# Altium schematic sheet Sensors.SchDoc: Sensors
size B; Author: Alexander Curtiss; DocumentNumber: 4; SheetNumber: 4; SheetTotal: 6
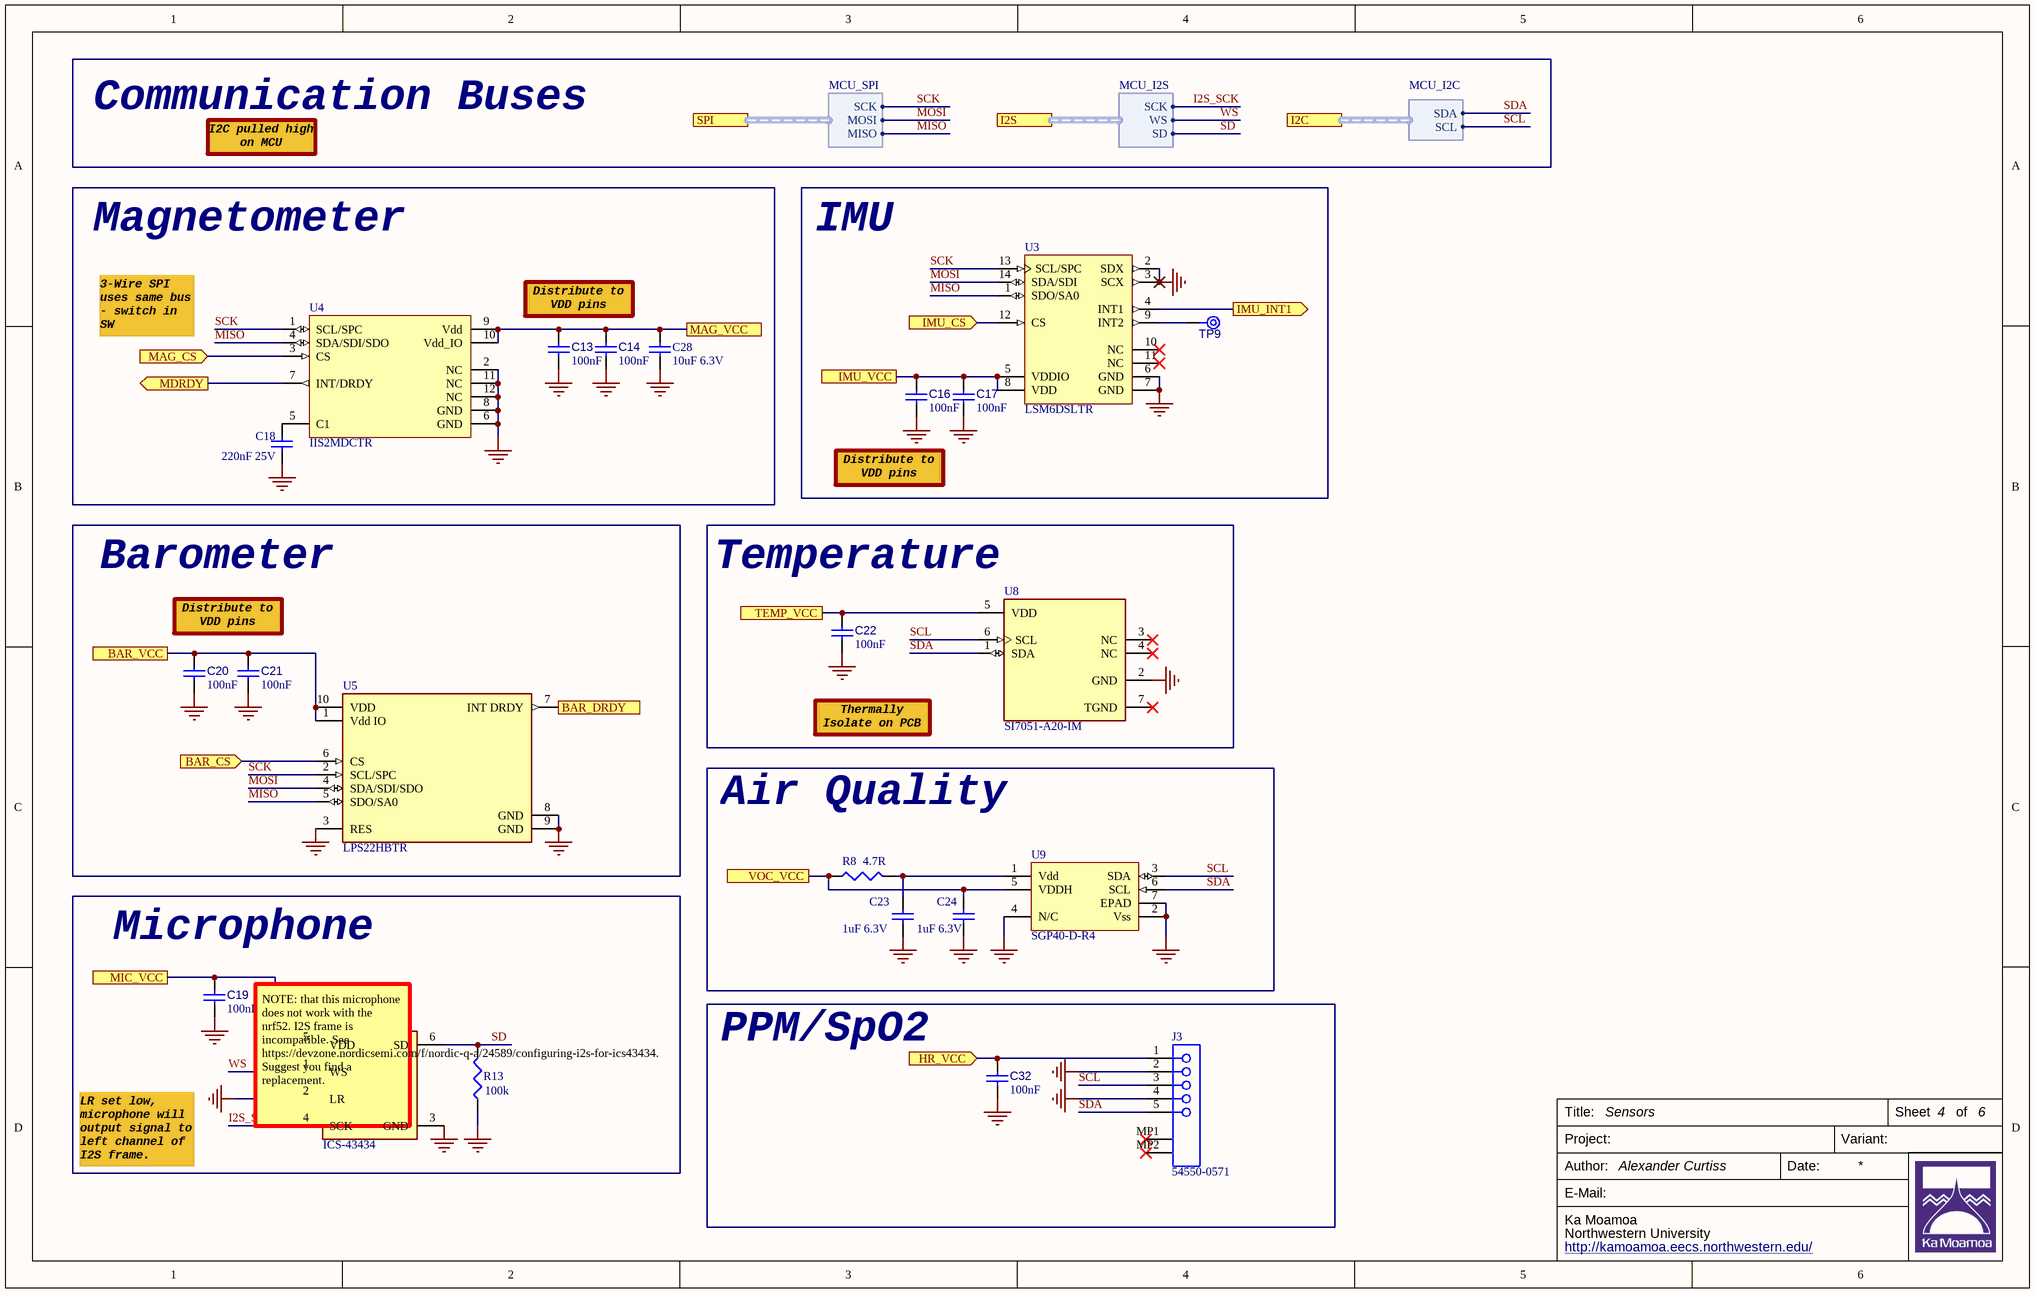
[diagram p0: Sensors.SchDoc]

## Parts
C13  value 100nF  [CAPC0402(1005)60_L]  (hidden comment: Capacitor 100nF +/-20% 25V 0402)
C14  value 100nF  [CAPC0402(1005)60_L]  (hidden comment: Capacitor 100nF +/-20% 25V 0402)
C16  value 100nF  [CAPC0402(1005)60_L]  (hidden comment: Capacitor 100nF +/-20% 25V 0402)
C17  value 100nF  [CAPC0402(1005)60_L]  (hidden comment: Capacitor 100nF +/-20% 25V 0402)
C18  220nF 25V  [CAPC0603(1608)100_N]
C19  value 100nF  [CAPC0402(1005)60_L]  (hidden comment: Capacitor 100nF +/-20% 25V 0402)
C20  value 100nF  [CAPC0402(1005)60_L]  (hidden comment: Capacitor 100nF +/-20% 25V 0402)
C21  value 100nF  [CAPC0402(1005)60_L]  (hidden comment: Capacitor 100nF +/-20% 25V 0402)
C22  value 100nF  [CAPC0402(1005)60_L]  (hidden comment: Capacitor 100nF +/-20% 25V 0402)
C23  1uF 6.3V  [CAPC1005X55X25ML5T10]
C24  1uF 6.3V  [CAPC1005X55X25ML5T10]
C28  10uF 6.3V  [CAPC1608X90X35NL10T15]
C32  value 100nF  [CAPC0402(1005)60_L]  (hidden comment: Capacitor 100nF +/-20% 25V 0402)
J3  54550-0571  [MOLX-54550-0571]
MK1  Part Number: ICS-43434  [InvenSense_ICS-43434_0]  (hidden comment: Mic_InvenSense_ICS-43434_eec)
R8  4.7R  [RESC1608X55X25NL10T15]
R13  100k  [RESC1608X55X25NL10T15]
TP9  VSTOR  [TP06R]  (value not drawn)  (no BOM)
U3  LSM6DSLTR  [STM-LGA-14_2500X3000X860]
U4  IIS2MDCTR  [LSM6DSLTR]
U5  LPS22HBTR  [FP-HLGA-10L-8479831-0]
U8  SI7051-A20-IM  [FP-SI7051-A20-IM-MFG]
U9  SGP40-D-R4  [SGP40-D-R4]

## Blocks framed on the sheet
Magnetometer: C13 C14 C18 C28 U4
IMU: C16 C17 TP9 U3
Barometer: C20 C21 U5
Temperature: C22 U8
Air Quality: C23 C24 R8 U9
Microphone: C19 MK1 R13
PPM/SpO2: C32 J3

## Ports
BAR_CS (in), BAR_DRDY (out), BAR_VCC, HR_VCC (in), I2C (harness MCU_I2C), I2S (harness MCU_I2S), IMU_CS (in), IMU_INT1 (out), IMU_VCC, MAG_CS (in), MAG_VCC, MDRDY (out), MIC_VCC, SPI (harness MCU_SPI), TEMP_VCC, VOC_VCC

## Harnesses
MCU_SPI: MISO, MOSI, SCK
MCU_I2S: SD, WS, SCK
MCU_I2C: SCL, SDA

## Nets
GND: C13.2 C14.2 C16.2 C17.2 C18.1 C19.2 C20.2 C21.2 C22.2 C23.1 C24.1 C28.1 C32.2 J3.2 J3.4 MK1.2(LR) MK1.3(GND) R13.1 U3.2(SDX) U3.3(SCX) U3.6(GND) U3.7(GND) U4.2(NC) U4.6(GND) U4.8(GND) U4.11(NC) U4.12(NC) U5.3(RES) U5.8(GND) U5.9(GND) U8.2(GND) U9.2(Vss) U9.4(N/C) U9.7(EPAD)
BAR_CS: U5.6(CS) ; port BAR_CS
BAR_DRDY: U5.7(INT_DRDY) ; port BAR_DRDY
BAR_VCC: C20.1 C21.1 U5.1(Vdd_IO) U5.10(VDD) ; port BAR_VCC
HR_VCC: C32.1 J3.1 ; port HR_VCC
I2S_SCK: MK1.4(SCK) ; port I2S.SCK
IMU_CS: U3.12(CS) ; port IMU_CS
IMU_INT1: U3.4(INT1) ; port IMU_INT1
IMU_VCC: C16.1 C17.1 U3.5(VDDIO) U3.8(VDD) ; port IMU_VCC
MAG_CS: U4.3(CS) ; port MAG_CS
MAG_VCC: C13.1 C14.1 C28.2 U4.9(Vdd) U4.10(Vdd_IO) ; port MAG_VCC
MDRDY: U4.7(INT/DRDY) ; port MDRDY
MIC_VCC: C19.1 MK1.5(VDD) ; port MIC_VCC
MISO: U3.1(SDO/SA0) U4.4(SDA/SDI/SDO) U5.5(SDO/SA0) ; port SPI.MISO
MOSI: U3.14(SDA/SDI) U5.4(SDA/SDI/SDO) ; port SPI.MOSI
SCK: U3.13(SCL/SPC) U4.1(SCL/SPC) U5.2(SCL/SPC) ; port SPI.SCK
SCL: J3.3 U8.6(SCL) U9.3(SDA) ; port I2C.SCL
SD: MK1.6(SD) R13.2 ; port I2S.SD
SDA: J3.5 U8.1(SDA) U9.6(SCL) ; port I2C.SDA
TEMP_VCC: C22.1 U8.5(VDD) ; port TEMP_VCC
VOC_VCC: C24.2 R8.1 U9.5(VDDH) ; port VOC_VCC
WS: MK1.1(WS) ; port I2S.WS
NetC18_2: C18.2 U4.5(C1)
NetC23_2: C23.2 R8.2 U9.1(Vdd)
NetTP9_1: TP9.1(TP) U3.9(INT2)

Not connected (* = marked no-connect by the designer): J3 MP1* MP2*; U3 10(NC)* 11(NC)*; U8 3(NC)* 4(NC)* 7(TGND)*

## Notes on the sheet
- Communication Buses
- I2C pulled high on MCU
- 3-Wire SPI uses same bus - switch in SW
- Distribute to VDD pins
- Thermally Isolate on PCB
- LR set low, microphone will output signal to left channel of I2S frame.
- (near MK1) NOTE: that this microphone does not work with the nrf52. I2S frame is incompatible. See https://devzone.nordicsemi.com/f/nordic-q-a/24589/configuring-i2s-for-ics43434. Suggest you find a replacement.
- Title:
- Sheet
- of
- Project:
- Author:
- Date:
- Variant:
- Ka Moamoa
- Northwestern University
- http://kamoamoa.eecs.northwestern.edu/
- E-Mail:

## Library data of the parts
C13 C14 C16 C17 C19-C22 C32 = CMP-001-00065-2: Chip Capacitor, 100nF +/-20%, 25V, 0402, Thickness 0.6 mm; Tolerance: 10%; Pins: 2; Min Operating Temperature: -55°C; Max Operating Temperature: 85°C; Mounting Technology: SMT; Case/Package: 0603; Voltage Rating: 25V
C18 = CMP-1035-02648-1: CAP 220nF 25V ±10% 0603 (1608 Metric) Thickness 1mm SMD; Tolerance: Â±10%; Case-Metric: 1608; Case-EIA: 0603; Value: 220nF; Rated Voltage: 25 V; Technology: SMT; Max Thickness: 1 mm
C23 C24 = CMP-2100-03591-1: Chip Capacitor, 1 uF, +/- 10%, 6.3 V, -55 to 85 degC, 1005 (0402 Metric), RoHS, Tape and Reel; Manufacturer: Yageo; Dielectric: X5R; Dielectric Material: Ceramic; Number of Pins: 2; Lead Free: LeadFree; Voltage Rating (DC): 6.3V; RoHSCompliant: True; Manufacturer URL: http://www.yageo.com/; Package Reference: 0402; REACH SVHC: NoSVHC; Tolerance: 10%; Case Code (Imperial): 0402; Width: 0.02inch; Case Code (Metric): 1005; Thickness: 0.022inch; Packaging: TapeandReel; Voltage Rating: 6.3V; Case/Package: 0402; Depth: 0.5mm; Max Operating Temperature: 85degC; Datasheet URL: http://www.yageo.com/documents/recent/UPY-GPHC_X5R_4V-to-50V_22.pdf; Composition: Ceramic; Length: 1mm; Radiation Hardening: No; Capacitance: 1uF; Height: 0.5mm; Mount: SurfaceMount; Datasheet Version: Rev. 22, 10/2016; Package Quantity: 1; Package Description: 2-Pin Surface Mount Device, Body 1 x 0.5 mm; Termination: SMD/SMT; Min Operating Temperature: -55degC
C28 = CMP-2006-02792-1: Part Number: GRM188R60J106ME47D; Manufacturer: Murata
J3 = CMP-1241-00559-1: 0.5 mm Pitch Easy-On(TM) Type FPC Connector, 1.2 mm Mated Height, Right Angle, ZIF, SMT, Top Contact, 5 Circuits, -20 to 85 degC, ELV and RoHS Compliant, Tape and Reel; Manufacturer: Molex; Stackable: No; Pitch - Mating Interface: 0.50mm; Mated Height: 1.20mm; Voltage (Max): 50V; Durability (mating cycles max): 20; Entry Angle: 90degrees Angle; Material - Plating Termination: Tin; Current (Max per Contact): 0.5A; Material - Metal: Phosphor Bronze; Material - Plating Mating: Gold; Polarized to PCB: Yes; Circuits (Loaded): 5; ComponentLink2URL: http://www.molex.com/webdocs/datasheets/pdf/en-us/0545500571_FFC_FPC_CONNECTORS.pdf; Orientation: Right Angle; ComponentLink1Description: Manufacturer URL; ComponentLink1URL: http://www.molex.com/molex/index.jsp; Mounting Technology: Surface Mount; Packing: Tape and Reel; RoHS: TRUE; Number of Rows: 1; PartNumber: 54550-0571; PackageReference: 54550-0571; ComponentLink3URL: http://www.molex.com/pdm_docs/sd/545500571_sd.pdf; PackageDescription: 5-Lead FPC Connector, Pitch 0.5 mm; ComponentLink2Description: Datasheet; PCB Retention: Yes; PackageVersion: Rev. M, 12/2009; Contact Position: Top; PCB Locator: No; ComponentLink3Description: Package Specification
MK1 = CMP-008-0000-1: MIC MEMS MULTI-MODE OMNI -26DB; Price: 2.41535279224; Design Item ID: Mic_InvenSense_ICS-43434_eec; ComponentLink2URL: https://www.invensense.com/wp-content/uploads/2016/02/DS-000069-ICS-43434-v1.1.pdf; Package: MIC_SMT_2MM65_3MM5; ComponentLink2Description: Datasheet; Lead Free: yes; Source: Mic_InvenSense_ICS-43434_eec.SchLib; Digikey Description: MIC MEMS MULTI-MODE OMNI -26DB; helpURL: https://upverter.com/upn/revision/74e8235c14aaa9d1/; ComponentLink1Description: Upverter; RoHS: TRUE; Digikey Part Number: 1428-1066-1-ND; Temperature Range High: +85°C; Temperature: − 40°C to +85°C; Manufacturer: InvenSense; Temperature Range Low: − 40°C; ComponentLink1URL: https://upverter.com/upn/revision/74e8235c14aaa9d1/
R8 = CMP-009-00177-2: Resistor 4.7Ω 1% 0603; Manufacturer 1: Yageo; Manufacturer Part Number 1: RC0603FR-074R7L; Voltage Rating: 50V; Power Rating: 100mW; Temperature Coefficient: 200ppm/°C; Supplier 1: Digi-Key; Supplier Part Number 1: YAG3371CT-ND; RoHS: Yes; Category: Chip SMD Resistors; Stock 1: 443175; Pricing 1: 1=0.10000, 10=0.04200, 100=0.01710, 1000=0.00766, 2500=0.00665 (USD); Case/Package: 0603; Number of Pins: 2; Case Code (Imperial): 0603; Case Code (Metric): 1608; Min Operating Temperature: -55°C; Max Operating Temperature: 155°C; Package Quantity: 5000; Resistance: 4.7R; Tolerance: 1%; Packaging: Tape and Reel; Voltage Rating (DC): 50V; Resistor Type: Thick Film; Number of Terminations: 2; Termination: SMD/SMT; Max Power Dissipation: 100mW; Features: Moisture Resistant; Length: 1.6mm; Width: 0.8mm; Height: 0.45mm; Depth: 0.8mm; REACH SVHC: Unknown; Lead Free: Lead Free; ComponentLink1URL: https://datasheet.ciiva.com/46440/1868787-46440910.pdf?src-supplier=Element14; ComponentLink1Description: https://datasheet.ciiva.com/46440/1868787-46440910.pdf?src-supplier=Element14; ComponentLink2URL: https://datasheet.ciiva.com/12555/rc0603-272842-12555071.pdf?src-supplier=Mouser; ComponentLink2Description: https://datasheet.ciiva.com/12555/rc0603-272842-12555071.pdf?src-supplier=Mouser
R13 = CMP-009-00177-2: Resistor 100kΩ 1% 0603; Manufacturer 1: Yageo; Manufacturer Part Number 1: RC0603FR-07100KL; Resistance: 100kR; Power Rating: 100mW; Temperature Coefficient: 100ppm/°C; Voltage Rating: 50V; Working Voltage: 75V; Supplier 1: Digi-Key; Supplier Part Number 1: 311-100KHRCT-ND; RoHS: Yes; Category: Chip SMD Resistors; Stock 1: 11096179; Pricing 1: 1=0.10000, 10=0.02100, 100=0.00850, 1000=0.00382, 2500=0.00331 (USD); Case/Package: 0603; Number of Pins: 2; Case Code (Imperial): 0603; Case Code (Metric): 1608; Min Operating Temperature: -55°C; Max Operating Temperature: 155°C; Packaging: Tape and Reel; Tolerance: 1%; Resistor Type: Thick Film; Termination: SMD/SMT; Number of Terminations: 2; Voltage Rating (DC): 50V; Length: 1.6mm; Width: 0.8mm; Height: 0.45mm; Depth: 0.8mm; Military Standard: Not; REACH SVHC: No SVHC; Lead Free: Lead Free; ComponentLink1URL: https://datasheet.ciiva.com/11808/0900766b80f96399-11808107.pdf?src-supplier=RSComponents; ComponentLink1Description: https://datasheet.ciiva.com/11808/0900766b80f96399-11808107.pdf?src-supplier=RSComponents; ComponentLink2URL: https://datasheet.ciiva.com/7983/443971-7983593.pdf?src-supplier=Element14; ComponentLink2Description: https://datasheet.ciiva.com/7983/443971-7983593.pdf?src-supplier=Element14; ComponentLink3URL: https://datasheet.ciiva.com/46440/1868787-46440889.pdf?src-supplier=Element14; ComponentLink3Description: https://datasheet.ciiva.com/46440/1868787-46440889.pdf?src-supplier=Element14; ComponentLink4URL: https://datasheet.ciiva.com/7746/1738695-7746234.pdf?src-supplier=Element14; ComponentLink4Description: https://datasheet.ciiva.com/7746/1738695-7746234.pdf?src-supplier=Element14; ComponentLink5URL: https://datasheet.ciiva.com/7746/1738695-7746235.pdf?src-supplier=Element14; ComponentLink5Description: https://datasheet.ciiva.com/7746/1738695-7746235.pdf?src-supplier=Element14; ComponentLink6URL: https://datasheet.ciiva.com/22747/443971-22747516.pdf?src-supplier=Element14; ComponentLink6Description: https://datasheet.ciiva.com/22747/443971-22747516.pdf?src-supplier=Element14
TP9 = CMP-00028-00002-2: 0.6mm round test point; Pins: 1
U3 = CMP-2000-07467-1: iNEMO Inertial Module:Always-on 3D Accelerometer and 3D Gyroscope, 1.71 to 3.6 V, -40 to 85 degC, 14-Pin LGA, RoHS, Tape and Reel; Manufacturer: STMicroelectronics; Datasheet URL: http://www.st.com/content/ccc/resource/technical/document/datasheet/ee/23/a0/dc/1d/68/45/52/DM00237456.pdf/files/DM00237456.pdf/jcr:content/translations/en.DM00237456.pdf; Mounting Technology: SurfaceMount; Datasheet Version: Rev. 6, 05/2017; RoHSCompliant: false; Package Reference: LGA-14_2500X3000X860; Manufacturer URL: http://www.st.com/; Package Description: 12-Pin Land Grid Array Package, Body 2.5 x 3 mm, Pitch 0.5 mm
U4 = CMP-010-00024-3: HIGH ACCURACY ULTRA-LOW-POWER 3-; Axis: X, Y, Z; Resolution: 16b; Sensing Method: Magnetoresistive; Output Type: SPI,I2C; Case/Package: LGA; Max Operating Temperature: 85°C; Packaging: Cut Tape; Number of Pins: 12; Min Operating Temperature: -40°C
U5 = CMP-12182-000004-1: MEMS NANO PRESSURE SENSOR: 260-1; Manufacturer: STMicroelectronics; Sensor Output: I2C,SPI; Port Style: No Port; Max Supply Voltage: 3.6V; Operating Supply Current: 3-12uA; Min Supply Voltage: 1.7V; Device Class L3: unset; Device Class L1: Sensors; Manufacturer Part Number: LPS22HBTR; Temperature Range High: +85°C; Digikey Description: MEMS NANO PRESSURE SENSOR: 260-1; Device Class L2: Pressure Sensors; RoHS: TRUE; Lead Free: Yes; Height: 0.8mm; Automotive: No; Octopart: https://octopart.com/lps22hbtr-stmicroelectronics-51851131; Package: HLGA-10L-8479831; Temperature Range Low: -40°C; Category: IC; Temperature: -40°C to +85°C; ComponentLink2Description: Datasheet; ComponentLink2URL: https://www.st.com/resource/en/datasheet/lps22hb.pdf; Footprint Url: https://www.st.com/content/ccc/resource/technical/document/technical_note/73/17/9c/16/dd/96/4a/01/CD00134799.pdf/files/CD00134799.pdf/jcr:content/translations/en.CD00134799.pdf
U8 = CMP-08164-000002-1: SENSOR DIGITAL -40C-125C 6DFN; Manufacturer: Silicon Labs; Interface: I2C; Operating Supply Current: 0.06-3500uA; Standoff Height: 0mm; Max Supply Voltage: 3.6V; Resolution: 14bits; Min Supply Voltage: 1.9V; Ambient Temperature Range High: +125°C; Digikey Description: SENSOR DIGITAL -40C-125C 6DFN; Package: SI7051-A20-IM; Device Class L2: Temperature and Humidity Sensors; Temperature Range Low: -40°C; Manufacturer Part Number: SI7051-A20-IM; Device Class L3: unset; Octopart: https://octopart.com/si7051-a20-im-silicon+labs-71522607; Ambient Temperature Range Low: -40°C; Height: 0.8mm; RoHS: TRUE; ComponentLink2Description: Datasheet; Ipc Land Pattern Name: DFN300X300X75-6; Category: IC; ComponentLink2URL: https://www.silabs.com/documents/public/data-sheets/Si7050-1-3-4-5-A20.pdf; Sensor Output: I2C; Lead Free: Yes; Automotive: No; Temperature Range High: +125°C; Temperature: -40°C to +125°C; Device Class L1: Sensors
U9 = CMP-010-00026-1: SGP40 Series 3.6 V 4 mA Indoor Air Quality Sensor for VOC Measurements - DFN-6